# Altium schematic sheet TensoSensor.SchDoc: Название платы
size 840 x 594 mm; ApprovedBy: Рогов; CheckedBy: Фамилия проверяющего; DrawnBy: Фамилия разработчика; DocumentNumber: Введите номер платы + Э3; SheetNumber: пусто если лист 1, иначе 1; SheetTotal: количество листов; Title1str: (вторая строка при необходимости); DocumentType: тип схемы; Format: A1; ImagePath: Введите номер платы
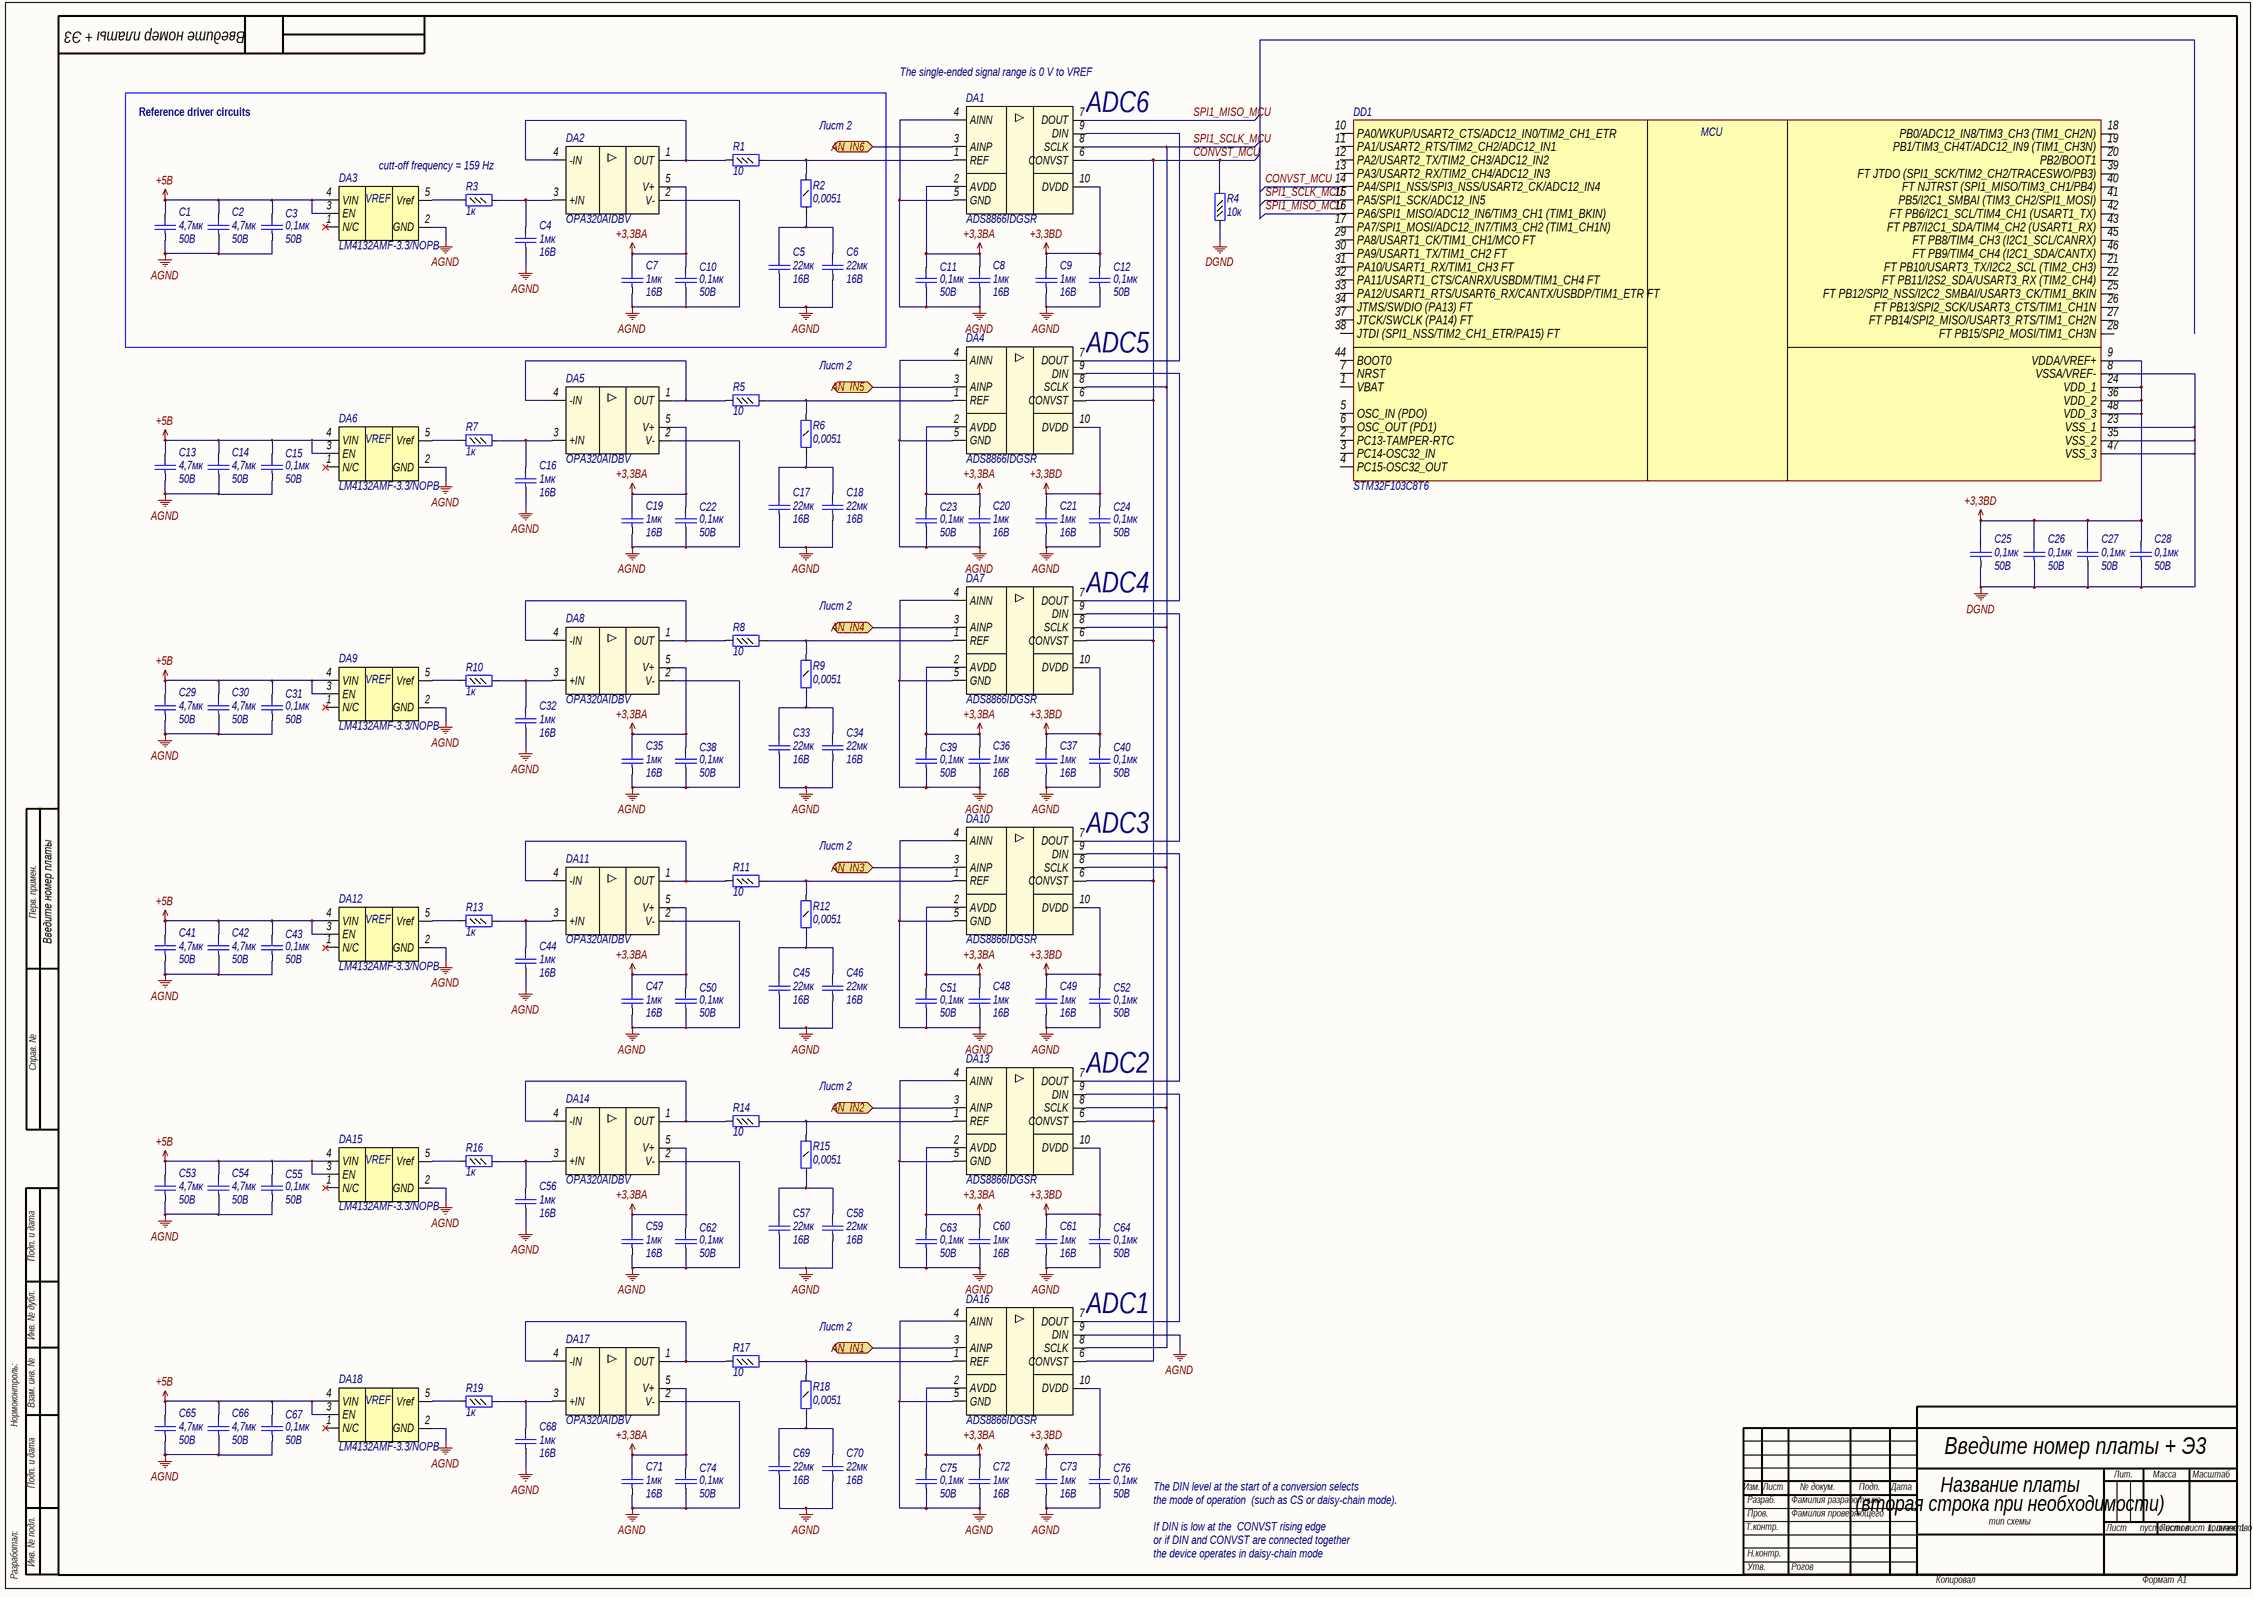
[diagram p0: TensoSensor.SchDoc]

## Parts
C1  Voltage: 50В  [C0805]  (hidden comment: 4,7мк)
C2  Voltage: 50В  [C0805]  (hidden comment: 4,7мк)
C3  Voltage: 50B  [C0603]  (hidden comment: 0,1мк)
C4  Voltage: 16B  [C0603]  (hidden comment: 1мк)
C5  Voltage: 16B  [C1210]  (hidden comment: 22мк)
C6  Voltage: 16B  [C1210]  (hidden comment: 22мк)
C7  Voltage: 16B  [C0603]  (hidden comment: 1мк)
C8  Voltage: 16B  [C0603]  (hidden comment: 1мк)
C9  Voltage: 16B  [C0603]  (hidden comment: 1мк)
C10  Voltage: 50B  [C0603]  (hidden comment: 0,1мк)
C11  Voltage: 50B  [C0603]  (hidden comment: 0,1мк)
C12  Voltage: 50B  [C0603]  (hidden comment: 0,1мк)
C13  Voltage: 50В  [C0805]  (hidden comment: 4,7мк)
C14  Voltage: 50В  [C0805]  (hidden comment: 4,7мк)
C15  Voltage: 50B  [C0603]  (hidden comment: 0,1мк)
C16  Voltage: 16B  [C0603]  (hidden comment: 1мк)
C17  Voltage: 16B  [C1210]  (hidden comment: 22мк)
C18  Voltage: 16B  [C1210]  (hidden comment: 22мк)
C19  Voltage: 16B  [C0603]  (hidden comment: 1мк)
C20  Voltage: 16B  [C0603]  (hidden comment: 1мк)
C21  Voltage: 16B  [C0603]  (hidden comment: 1мк)
C22  Voltage: 50B  [C0603]  (hidden comment: 0,1мк)
C23  Voltage: 50B  [C0603]  (hidden comment: 0,1мк)
C24  Voltage: 50B  [C0603]  (hidden comment: 0,1мк)
C25  Voltage: 50B  [C0603]  (hidden comment: 0,1мк)
C26  Voltage: 50B  [C0603]  (hidden comment: 0,1мк)
C27  Voltage: 50B  [C0603]  (hidden comment: 0,1мк)
C28  Voltage: 50B  [C0603]  (hidden comment: 0,1мк)
C29  Voltage: 50В  [C0805]  (hidden comment: 4,7мк)
C30  Voltage: 50В  [C0805]  (hidden comment: 4,7мк)
C31  Voltage: 50B  [C0603]  (hidden comment: 0,1мк)
C32  Voltage: 16B  [C0603]  (hidden comment: 1мк)
C33  Voltage: 16B  [C1210]  (hidden comment: 22мк)
C34  Voltage: 16B  [C1210]  (hidden comment: 22мк)
C35  Voltage: 16B  [C0603]  (hidden comment: 1мк)
C36  Voltage: 16B  [C0603]  (hidden comment: 1мк)
C37  Voltage: 16B  [C0603]  (hidden comment: 1мк)
C38  Voltage: 50B  [C0603]  (hidden comment: 0,1мк)
C39  Voltage: 50B  [C0603]  (hidden comment: 0,1мк)
C40  Voltage: 50B  [C0603]  (hidden comment: 0,1мк)
C41  Voltage: 50В  [C0805]  (hidden comment: 4,7мк)
C42  Voltage: 50В  [C0805]  (hidden comment: 4,7мк)
C43  Voltage: 50B  [C0603]  (hidden comment: 0,1мк)
C44  Voltage: 16B  [C0603]  (hidden comment: 1мк)
C45  Voltage: 16B  [C1210]  (hidden comment: 22мк)
C46  Voltage: 16B  [C1210]  (hidden comment: 22мк)
C47  Voltage: 16B  [C0603]  (hidden comment: 1мк)
C48  Voltage: 16B  [C0603]  (hidden comment: 1мк)
C49  Voltage: 16B  [C0603]  (hidden comment: 1мк)
C50  Voltage: 50B  [C0603]  (hidden comment: 0,1мк)
C51  Voltage: 50B  [C0603]  (hidden comment: 0,1мк)
C52  Voltage: 50B  [C0603]  (hidden comment: 0,1мк)
C53  Voltage: 50В  [C0805]  (hidden comment: 4,7мк)
C54  Voltage: 50В  [C0805]  (hidden comment: 4,7мк)
C55  Voltage: 50B  [C0603]  (hidden comment: 0,1мк)
C56  Voltage: 16B  [C0603]  (hidden comment: 1мк)
C57  Voltage: 16B  [C1210]  (hidden comment: 22мк)
C58  Voltage: 16B  [C1210]  (hidden comment: 22мк)
C59  Voltage: 16B  [C0603]  (hidden comment: 1мк)
C60  Voltage: 16B  [C0603]  (hidden comment: 1мк)
C61  Voltage: 16B  [C0603]  (hidden comment: 1мк)
C62  Voltage: 50B  [C0603]  (hidden comment: 0,1мк)
C63  Voltage: 50B  [C0603]  (hidden comment: 0,1мк)
C64  Voltage: 50B  [C0603]  (hidden comment: 0,1мк)
C65  Voltage: 50В  [C0805]  (hidden comment: 4,7мк)
C66  Voltage: 50В  [C0805]  (hidden comment: 4,7мк)
C67  Voltage: 50B  [C0603]  (hidden comment: 0,1мк)
C68  Voltage: 16B  [C0603]  (hidden comment: 1мк)
C69  Voltage: 16B  [C1210]  (hidden comment: 22мк)
C70  Voltage: 16B  [C1210]  (hidden comment: 22мк)
C71  Voltage: 16B  [C0603]  (hidden comment: 1мк)
C72  Voltage: 16B  [C0603]  (hidden comment: 1мк)
C73  Voltage: 16B  [C0603]  (hidden comment: 1мк)
C74  Voltage: 50B  [C0603]  (hidden comment: 0,1мк)
C75  Voltage: 50B  [C0603]  (hidden comment: 0,1мк)
C76  Voltage: 50B  [C0603]  (hidden comment: 0,1мк)
DA1  Part Number: ADS8866IDGSR  [MSOP10]  (hidden comment: ADS8866)
DA2  Part Number: OPA320AIDBV  [SOT23-5]  (hidden comment: OPA320)
DA3  Part Number: LM4132AMF-3.3/NOPB  [SOT23-5]  (hidden comment: LM4132)
DA4  Part Number: ADS8866IDGSR  [MSOP10]  (hidden comment: ADS8866)
DA5  Part Number: OPA320AIDBV  [SOT23-5]  (hidden comment: OPA320)
DA6  Part Number: LM4132AMF-3.3/NOPB  [SOT23-5]  (hidden comment: LM4132)
DA7  Part Number: ADS8866IDGSR  [MSOP10]  (hidden comment: ADS8866)
DA8  Part Number: OPA320AIDBV  [SOT23-5]  (hidden comment: OPA320)
DA9  Part Number: LM4132AMF-3.3/NOPB  [SOT23-5]  (hidden comment: LM4132)
DA10  Part Number: ADS8866IDGSR  [MSOP10]  (hidden comment: ADS8866)
DA11  Part Number: OPA320AIDBV  [SOT23-5]  (hidden comment: OPA320)
DA12  Part Number: LM4132AMF-3.3/NOPB  [SOT23-5]  (hidden comment: LM4132)
DA13  Part Number: ADS8866IDGSR  [MSOP10]  (hidden comment: ADS8866)
DA14  Part Number: OPA320AIDBV  [SOT23-5]  (hidden comment: OPA320)
DA15  Part Number: LM4132AMF-3.3/NOPB  [SOT23-5]  (hidden comment: LM4132)
DA16  Part Number: ADS8866IDGSR  [MSOP10]  (hidden comment: ADS8866)
DA17  Part Number: OPA320AIDBV  [SOT23-5]  (hidden comment: OPA320)
DA18  Part Number: LM4132AMF-3.3/NOPB  [SOT23-5]  (hidden comment: LM4132)
DD1  STM32F103C8T6  [LQFP48]
R1  value 10  [R0603]  (hidden comment: Resistor_0,062Вт)
R2  value 0,0051  [R1206]  (hidden comment: Resistor_0,25Вт)
R3  value 1к  [R0603]  (hidden comment: Resistor_0,062Вт)
R4  value 10к  [R0603]  (hidden comment: Resistor_0,062Вт)
R5  value 10  [R0603]  (hidden comment: Resistor_0,062Вт)
R6  value 0,0051  [R1206]  (hidden comment: Resistor_0,25Вт)
R7  value 1к  [R0603]  (hidden comment: Resistor_0,062Вт)
R8  value 10  [R0603]  (hidden comment: Resistor_0,062Вт)
R9  value 0,0051  [R1206]  (hidden comment: Resistor_0,25Вт)
R10  value 1к  [R0603]  (hidden comment: Resistor_0,062Вт)
R11  value 10  [R0603]  (hidden comment: Resistor_0,062Вт)
R12  value 0,0051  [R1206]  (hidden comment: Resistor_0,25Вт)
R13  value 1к  [R0603]  (hidden comment: Resistor_0,062Вт)
R14  value 10  [R0603]  (hidden comment: Resistor_0,062Вт)
R15  value 0,0051  [R1206]  (hidden comment: Resistor_0,25Вт)
R16  value 1к  [R0603]  (hidden comment: Resistor_0,062Вт)
R17  value 10  [R0603]  (hidden comment: Resistor_0,062Вт)
R18  value 0,0051  [R1206]  (hidden comment: Resistor_0,25Вт)
R19  value 1к  [R0603]  (hidden comment: Resistor_0,062Вт)

## Ports
AN_IN1, AN_IN2, AN_IN3, AN_IN4, AN_IN5, AN_IN6

## Nets
+3,3BA: C7.2 C8.2 C10.2 C11.2 C19.2 C20.2 C22.2 C23.2 C35.2 C36.2 C38.2 C39.2 C47.2 C48.2 C50.2 C51.2 C59.2 C60.2 C62.2 C63.2 C71.2 C72.2 C74.2 C75.2 DA1.2(AVDD) DA2.5(V+) DA4.2(AVDD) DA5.5(V+) DA7.2(AVDD) DA8.5(V+) DA10.2(AVDD) DA11.5(V+) DA13.2(AVDD) DA14.5(V+) DA16.2(AVDD) DA17.5(V+)
+3,3BD: C9.2 C12.2 C21.2 C24.2 C25.2 C26.2 C27.2 C28.2 C37.2 C40.2 C49.2 C52.2 C61.2 C64.2 C73.2 C76.2 DA1.10(DVDD) DA4.10(DVDD) DA7.10(DVDD) DA10.10(DVDD) DA13.10(DVDD) DA16.10(DVDD) DD1.9(VDDA/VREF+) DD1.24(VDD_1) DD1.36(VDD_2) DD1.48(VDD_3)
+5B: C1.2 C2.2 C3.2 C13.2 C14.2 C15.2 C29.2 C30.2 C31.2 C41.2 C42.2 C43.2 C53.2 C54.2 C55.2 C65.2 C66.2 C67.2 DA3.3(EN) DA3.4(VIN) DA6.3(EN) DA6.4(VIN) DA9.3(EN) DA9.4(VIN) DA12.3(EN) DA12.4(VIN) DA15.3(EN) DA15.4(VIN) DA18.3(EN) DA18.4(VIN)
AGND: C1.1 C2.1 C3.1 C4.1 C5.1 C6.1 C7.1 C8.1 C9.1 C10.1 C11.1 C12.1 C13.1 C14.1 C15.1 C16.1 C17.1 C18.1 C19.1 C20.1 C21.1 C22.1 C23.1 C24.1 C29.1 C30.1 C31.1 C32.1 C33.1 C34.1 C35.1 C36.1 C37.1 C38.1 C39.1 C40.1 C41.1 C42.1 C43.1 C44.1 C45.1 C46.1 C47.1 C48.1 C49.1 C50.1 C51.1 C52.1 C53.1 C54.1 C55.1 C56.1 C57.1 C58.1 C59.1 C60.1 C61.1 C62.1 C63.1 C64.1 C65.1 C66.1 C67.1 C68.1 C69.1 C70.1 C71.1 C72.1 C73.1 C74.1 C75.1 C76.1 DA1.4(AINN) DA1.5(GND) DA2.2(V-) DA3.2(GND) DA4.4(AINN) DA4.5(GND) DA5.2(V-) DA6.2(GND) DA7.4(AINN) DA7.5(GND) DA8.2(V-) DA9.2(GND) DA10.4(AINN) DA10.5(GND) DA11.2(V-) DA12.2(GND) DA13.4(AINN) DA13.5(GND) DA14.2(V-) DA15.2(GND) DA16.4(AINN) DA16.5(GND) DA16.9(DIN) DA17.2(V-) DA18.2(GND)
DGND: C25.1 C26.1 C27.1 C28.1 DD1.8(VSSA/VREF-) DD1.23(VSS_1) DD1.35(VSS_2) DD1.47(VSS_3) R4.1
AN_IN1: DA16.3(AINP) ; port AN_IN1
AN_IN2: DA13.3(AINP) ; port AN_IN2
AN_IN3: DA10.3(AINP) ; port AN_IN3
AN_IN4: DA7.3(AINP) ; port AN_IN4
AN_IN5: DA4.3(AINP) ; port AN_IN5
AN_IN6: DA1.3(AINP) ; port AN_IN6
CONVST_MCU: DA1.6(CONVST) DA4.6(CONVST) DA7.6(CONVST) DA10.6(CONVST) DA13.6(CONVST) DA16.6(CONVST) DD1.14(PA4/SPI1_NSS/SPI3_NSS/USART2_CK/ADC12_IN4) R4.2
SPI1_MISO_MCU: DA1.7(DOUT) DD1.16(PA6/SPI1_MISO/ADC12_IN6/TIM3_CH1_(TIM1_BKIN))
SPI1_SCLK_MCU: DA1.8(SCLK) DA4.8(SCLK) DA7.8(SCLK) DA10.8(SCLK) DA13.8(SCLK) DA16.8(SCLK) DD1.15(PA5/SPI1_SCK/ADC12_IN5)
NetC4_2: C4.2 DA2.3(+IN) R3.2
NetC5_2: C5.2 C6.2 R2.1
NetC16_2: C16.2 DA5.3(+IN) R7.2
NetC17_2: C17.2 C18.2 R6.1
NetC32_2: C32.2 DA8.3(+IN) R10.2
NetC33_2: C33.2 C34.2 R9.1
NetC44_2: C44.2 DA11.3(+IN) R13.2
NetC45_2: C45.2 C46.2 R12.1
NetC56_2: C56.2 DA14.3(+IN) R16.2
NetC57_2: C57.2 C58.2 R15.1
NetC68_2: C68.2 DA17.3(+IN) R19.2
NetC69_2: C69.2 C70.2 R18.1
NetDA1_1: DA1.1(REF) R1.2 R2.2
NetDA1_9: DA1.9(DIN) DA4.7(DOUT)
NetDA2_1: DA2.1(OUT) DA2.4(-IN) R1.1
NetDA3_5: DA3.5(Vref) R3.1
NetDA4_1: DA4.1(REF) R5.2 R6.2
NetDA4_9: DA4.9(DIN) DA7.7(DOUT)
NetDA5_1: DA5.1(OUT) DA5.4(-IN) R5.1
NetDA6_5: DA6.5(Vref) R7.1
NetDA7_1: DA7.1(REF) R8.2 R9.2
NetDA7_9: DA7.9(DIN) DA10.7(DOUT)
NetDA8_1: DA8.1(OUT) DA8.4(-IN) R8.1
NetDA9_5: DA9.5(Vref) R10.1
NetDA10_1: DA10.1(REF) R11.2 R12.2
NetDA10_9: DA10.9(DIN) DA13.7(DOUT)
NetDA11_1: DA11.1(OUT) DA11.4(-IN) R11.1
NetDA12_5: DA12.5(Vref) R13.1
NetDA13_1: DA13.1(REF) R14.2 R15.2
NetDA13_9: DA13.9(DIN) DA16.7(DOUT)
NetDA14_1: DA14.1(OUT) DA14.4(-IN) R14.1
NetDA15_5: DA15.5(Vref) R16.1
NetDA16_1: DA16.1(REF) R17.2 R18.2
NetDA17_1: DA17.1(OUT) DA17.4(-IN) R17.1
NetDA18_5: DA18.5(Vref) R19.1

Not connected (* = marked no-connect by the designer): DA3 1(N/C)*; DA6 1(N/C)*; DA9 1(N/C)*; DA12 1(N/C)*; DA15 1(N/C)*; DA18 1(N/C)*; DD1 1(VBAT) 2(PC13-TAMPER-RTC) 3(PC14-OSC32_IN) 4(PC15-OSC32_OUT) 5(OSC_IN_(PDO)) 6(OSC_OUT_(PD1)) 7(NRST) 10(PA0/WKUP/USART2_CTS/ADC12_IN0/TIM2_CH1_ETR) 11(PA1/USART2_RTS/TIM2_CH2/ADC12_IN1) 12(PA2/USART2_TX/TIM2_CH3/ADC12_IN2) 13(PA3/USART2_RX/TIM2_CH4/ADC12_IN3) 17(PA7/SPI1_MOSI/ADC12_IN7/TIM3_CH2_(TIM1_CH1N)) 18(PB0/ADC12_IN8/TIM3_CH3_(TIM1_CH2N)) 19(PB1/TIM3_CH4T/ADC12_IN9_(TIM1_CH3N)) 20(PB2/BOOT1) 21(FT_PB10/USART3_TX/I2C2_SCL_(TIM2_CH3)) 22(FT_PB11/I2S2_SDA/USART3_RX_(TIM2_CH4)) 25(FT_PB12/SPI2_NSS/I2C2_SMBAI/USART3_CK/TIM1_BKIN) 26(FT_PB13/SPI2_SCK/USART3_CTS/TIM1_CH1N) 27(FT_PB14/SPI2_MISO/USART3_RTS/TIM1_CH2N) 28(FT_PB15/SPI2_MOSI/TIM1_CH3N) 29(PA8/USART1_CK/TIM1_CH1/MCO_FT) 30(PA9/USART1_TX/TIM1_CH2_FT) 31(PA10/USART1_RX/TIM1_CH3_FT) 32(PA11/USART1_CTS/CANRX/USBDM/TIM1_CH4_FT) 33(PA12/USART1_RTS/USART6_RX/CANTX/USBDP/TIM1_ETR_FT) 34(JTMS/SWDIO_(PA13)_FT) 37(JTCK/SWCLK_(PA14)_FT) 38(JTDI_(SPI1_NSS/TIM2_CH1_ETR/PA15)_FT) 39(FT_JTDO_(SPI1_SCK/TIM2_CH2/TRACESWO/PB3)) 40(FT_NJTRST_(SPI1_MISO/TIM3_CH1/PB4)) 41(PB5/I2C1_SMBAI_(TIM3_CH2/SPI1_MOSI)) 42(FT_PB6/I2C1_SCL/TIM4_CH1_(USART1_TX)) 43(FT_PB7/I2C1_SDA/TIM4_CH2_(USART1_RX)) 44(BOOT0) 45(FT_PB8/TIM4_CH3_(I2C1_SCL/CANRX)) 46(FT_PB9/TIM4_CH4_(I2C1_SDA/CANTX))

## Notes on the sheet
- The single-ended signal range is 0 V to VREF
- Reference driver circuits
- Лист 2
- (near DA1) ADC6
- cutt-off frequency = 159 Hz
- (near DA4) ADC5
- (near DA7) ADC4
- (near DA10) ADC3
- Перв. примен.
- Справ. №
- (near DA13) ADC2
- Подп. и дата
- Инв. № дубл.
- (near DA16) ADC1
- Нормоконтроль:
- Взам. инв. №
- The DIN level at the start of a conversion selects
- Изм.
- Лист
- № докум.
- Подп.
- Дата
- Лит.
- Масса
- Масштаб
- the mode of operation  (such as CS or daisy-chain mode).
- If DIN is low at the  CONVST rising edge
- Т.контр.
- Пров.
- Разраб.
- Листов
- Разработал:
- Инв. № подл.
- or if DIN and CONVST are connected together
- the device operates in daisy-chain mode
- Н.контр.
- Утв.
- Копировал
- Формат
- (in symbol LM4132AMF-3.3/NOPB) VREF
- (in symbol microcont0) MСU

## Library data of the parts
C1 C2 C13 C14 C29 C30 C41 C42 C53 C54 C65 C66 = cap224: Конденсатор; Part Name: Ceramic; Manufacture: Murata; Part Number: GRM21BZ71H475KE15L; id: cap224; TKE: X7R; Value: 4,7мк
C3 C10-C12 C15 C22-C28 C31 C38-C40 C43 C50-C52 C55 C62-C64 C67 C74-C76 = cap131: Конденсатор; Part Name: Ceramic; Manufacture: Murata; Part Number: GRM188R71H104KA93D; id: cap131; TKE: X7R; Value: 0,1мк
C4 C7-C9 C16 C19-C21 C32 C35-C37 C44 C47-C49 C56 C59-C61 C68 C71-C73 = cap133: Конденсатор; Part Name: Ceramic; Manufacture: Murata; Part Number: GRM188R71C105KA12D**; id: cap133; TKE: X7R; Value: 1мк
C5 C6 C17 C18 C33 C34 C45 C46 C57 C58 C69 C70 = cap294: Конденсатор; Part Name: MLCC; Manufacture: TDK; Part Number: C3225X7R1C226M; id: cap294; TKE: X7R; tga: 0,20%; Value: 22мк
DA1 DA4 DA7 DA10 DA13 DA16 = ADS8866IDGSR: 100-kSPS, serial interface, micropower, miniature,  single-ended input, SAR; Part Name: SAR analog-to-digital converter; Manufacture: Texas Instruments; id: adc4; Interface: SPI; Resolution: 16bit; Sample frequence: 100 kS/s; Channels: 1; Type Supply: Single Polar; Current Consumption: 50nA; Power Supply: 2.7-3.6V; ADC: SAR; Input channel: Single-Ended
DA2 DA5 DA8 DA11 DA14 DA17 = amp25: Precision, 20-MHz, 0.9-pA, Low-Noise, RRIO; Part Name: Precision Low-Noise RRIO CMOS Amplifier; Manufacture: Texas Instruments; id: amp25; Rail-to-rail: yes; Supply Voltage: 1,8-5,5B; Supply Current max: 1,45mA; Bandwidth: 20MHz; Input Bias Current: 0,9pA; CMRR: 114dB; PSRR: 100dB; Offset voltage: 150uB; Channels: 1
DA3 DA6 DA9 DA12 DA15 DA18 = LM4132AMF-3.3/NOPB: Precision Low Dropout Voltage Reference; Manufacturer: Texas Instruments; id: ref4; Voltage min stabilize: 3,3B; Max input voltage: 5,5B; Accuracy: 0,0005; Working current: 60uA; Output current: 20mA; Part Name: Precision Low Dropout Voltage Reference
DD1 = microcont0: Medium-density performance line ARM®-based 32-bit MCU with 64  or 128 KB Flash, USB, CAN, 7 timers, 2 ADCs, 9 com. interfaces; Part Name: Microcontroller; Frequency: 72MHz; ADC: 10x12b; Interface: can, i2c, irda, lin, spi, uart, usb; Flash: 64kb; Pin in: 37; Power Supply: 2.0-3.6 V; id: microcont0; Part Number: STM32F103C8T6
R1 R5 R8 R11 R14 R17 = res415: Резистор; Manufacture: Yageo; Part Number: RC0603FR-0710RL; id: res415; Accuracy: 0,01; Part Name: Resistor; Power: 0,062Вт
R2 R6 R9 R12 R15 R18 = res1314: Резистор; Manufacture: Yageo; Part Number: RC1206JR-075M1L; Accuracy: 0,05; Power: 0,25Вт; id: res1314; Part Name: Resistor
R3 R7 R10 R13 R16 R19 = res463: Резистор; Manufacture: Yageo; Part Number: RC0603FR-071KL; id: res463; Accuracy: 0,01; Part Name: Resistor; Power: 0,062Вт
R4 = res487: Резистор; Manufacture: Yageo; Part Number: RC0603FR-0710KL; id: res487; Accuracy: 0,01; Part Name: Resistor; Power: 0,062Вт